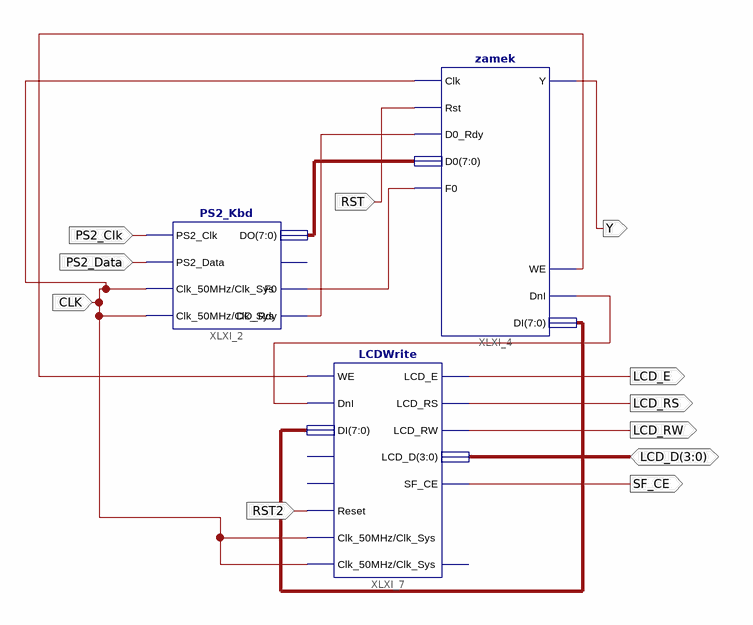
[diagram p0: schematic sheet 1]
// Xilinx ISE schematic schemat.sch (spartan3e) as structural Verilog: 3 symbols, 11 ports
module schemat (
  input  CLK,
  input  PS2_Clk,
  input  PS2_Data,
  input  RST,
  input  RST2,
  inout  [3:0] LCD_D,
  output Y,
  output LCD_E,
  output LCD_RS,
  output LCD_RW,
  output SF_CE
);

  wire XLXN_2, XLXN_10, XLXN_13, XLXN_14;
  wire [7:0] XLXN_1, XLXN_15;

  PS2_Kbd XLXI_2 (
    .PS2_Clk(PS2_Clk), .PS2_Data(PS2_Data), .Clk_50MHz(CLK), .F0(XLXN_10), .DO_Rdy(XLXN_2), .DO(XLXN_1),
    .Clk_Sys(CLK));  // open: E0
  zamek XLXI_4 (
    .Clk(CLK), .Rst(RST), .D0_Rdy(XLXN_2), .F0(XLXN_10), .D0(XLXN_1), .Y(Y), .WE(XLXN_13), .DnI(XLXN_14),
    .DI(XLXN_15));
  LCDWrite XLXI_7 (
    .WE(XLXN_13), .DnI(XLXN_14), .Reset(RST2), .DI(XLXN_15), .LCD_E(LCD_E), .LCD_RS(LCD_RS), .LCD_RW(LCD_RW),
    .LCD_D(LCD_D), .SF_CE(SF_CE), .Clk_50MHz(CLK), .Clk_Sys(CLK));  // open: Cursor, Blink, Busy
endmodule
